# EAGLE schematic pulse_module (EAGLE 9.2.2)
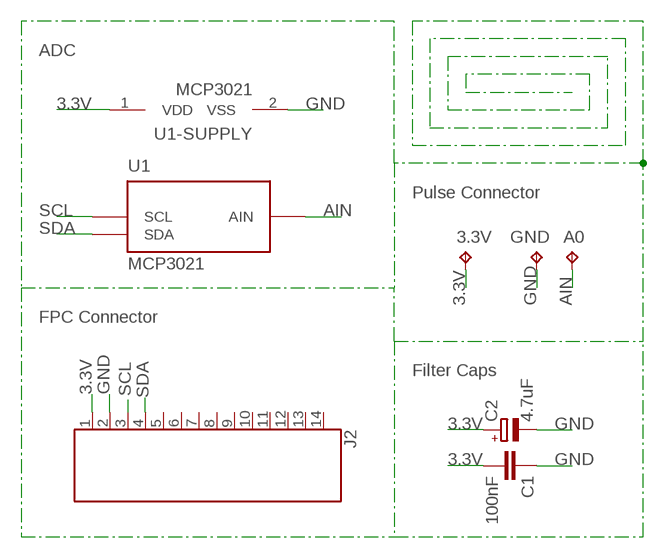
[diagram p0: schematic, sheet 1]

## Parts
3.3V  TPTP20R  [TP20R]
A0  TPTP20R  [TP20R]
C1  100nF  C-EUC1206  [C1206]
C2  4.7uF  CPOL-EUSMCA  [SMC_A]
GND  TPTP20R  [TP20R]
J2  686114183522  [686114183522]
U1  MCP3021  [SOT-23-5]

## Nets
3.3V: 3.3V.TP C1.2 C2.+ J2.1 U1.1(VDD)
AIN: A0.TP U1.3(AIN)
GND: C1.1 C2.- GND.TP J2.2 U1.2(VSS)
SCL: J2.3 U1.5(SCL)
SDA: J2.4 U1.4(SDA)
Unconnected: J2.5 J2.6 J2.7 J2.8 J2.9 J2.10 J2.11 J2.12 J2.13 J2.14

## Notes on the sheet
- ADC
- Pulse Connector
- FPC Connector
- Filter Caps

## Library data of the parts
3.3V A0 GND = testpad:TP: Test pad
C1 = rcl:C-EU: CAPACITOR, European symbol; SPICEPREFIX: C
C2 = rcl:CPOL-EU: POLARIZED CAPACITOR, European symbol; SPICEPREFIX: C
J2 = Wurth_Elektronik_Electromechanic_FPC_Connectors_&_Flat_Flexible_Cable_rev18c:686114183522: 686114183522 WR-FPC 1.00mm SMT Horizontal Bottom Contact - Low Profile <http://katalog.we-online.de/media/images/v2/Family_WR-FPC_6861xx183522.jpg> Details see: http://katalog.we-online.de/en/em/FPC_1_00_SMT_ZIF_HORIZONTAL_BOTTOM_CONTACT_LOW_PROFILE_6861xx183522 Created by Yingchun,shan 2016 (C) Wurth Elektronik
U1 = Volks73-MicrochipTechnology:MCP3*21: Analog-to-Digital Converter Low Power 10-, 12-Bit A/D Converter with I22™ Interface Documentation Datasheet <http://ww1.microchip.com/downloads/en/DeviceDoc/21805B.pdf> General Description The Microchip Technology Inc. MCP3021 is a successive approximation A/D converter (ADC) with 10-bit resolution. Available in the SOT-23 package, this device provides one single-ended input with very low power consumption. Based on an advanced CMOS technology, the MCP3021 provides a low maximum conversion current and standby current of 250 µA and 1 µA, respectively. Low current consumption, combined with the small SOT-23 package, make this device ideal for battery-powered and remote data acquisition applications. Communication to the MCP3021 is performed using a 2-wire I2C compatible interface. Standard (100 kHz) and Fast (400 kHz) I2C modes are available with the device. An on-chip conversion clock enables independent timing for the I2C and conversion clocks. The device is also addressable, allowing up to eight devices on a single 2-wire bus. The MCP3021 runs on a single supply voltage that operates over a broad range of 2.7V to 5.5V. This device also provides excellent linearity of ±1 LSB differential non-linearity (DNL) and ±1 LSB integral nonlinearity (INL), maximum. Features 10-bit resolution ±1 LSB DNL, ±1 LSB INL max. 250 µA max conversion current 5 nA typical standby current, 1 µA max. I2C™ compatible serial interface 100 kHz I2C Standard mode 400 kHz I2C Fast mode Up to 8 devices on single 2-wire bus 22.3 ksps in I2C Fast mode Single-ended analog input channel On-chip sample and hold On-chip conversion clock Single supply specified operation: 2.7V to 5.5V Temperature range: Extended: -40°C to +125°C Small SOT-23 package Applications Data Logging Multi-zone Monitoring Hand Held Portable Applications Battery Powered Test Equipment Remote or Isolated Data Acquisition; ARCHITECTURE: SAR; CONFIGURATION: S/H-ADC; DATA_INTERFACE: I2C; DESCRIPTION: IC ADC 10BIT 2.7V 1CH SOT23-5; DOCUMENTATION_LINK: <a href="http://ww1.microchip.com/downloads/en/DeviceDoc/21805B.pdf">Datasheet</a>; DOCUMENTATION_URL: http://ww1.microchip.com/downloads/en/DeviceDoc/21805B.pdf; FEATURES: -; INPUT_TYPE: Single Ended; MANUFACTURER: Microchip Technology; NUMBER_OF_AD_CONVERTERS: 1; NUMBER_OF_BITS: 10; NUMBER_OF_INPUTS: 1; OPERATING_TEMPERATURE: -40C ~ 125C; PACKAGE: SC-74A, SOT-753; PART_NUMBER: MCP3021A5T-E/OT; RATIO: 1:1; REFERENCE_TYPE: External; SAMPLING_RATE: 22.3k; SUPPLIER_DEVICE_PACKAGE: SOT-23-5; SUPPLIER_ITEM_INFO: http://www.digikey.com/product-detail/en/MCP3021A5T-E%2FOT/MCP3021A5T-E%2FOTCT-ND/1979808; SUPPLIER_ITEM_LINK: <a href="http://www.digikey.com/product-detail/en/MCP3021A5T-E%2FOT/MCP3021A5T-E%2FOTCT-ND/1979808">Details</a>; SUPPLIER_ITEM_NUMBER: MCP3021A5T-E/OTCT-ND; SUPPLIER_ITEM_URL: http://www.digikey.com/product-detail/en/MCP3021A5T-E%2FOT/MCP3021A5T-E%2FOTCT-ND/1979808; SUPPLIER_LINK: <a href="http://www.digikey.com">Home Page</a>; SUPPLIER_NAME: Digi-Key; SUPPLIER_URL: http://www.digikey.com; VOLTAGE-SUPPLY_ANALOG: 2.7V ~ 5.5V; VOLTAGE-SUPPLY_DIGITAL: 2.7V ~ 5.5V

## Net classes
0 default: width 0.254 mm, drill 0.508 mm, clearance 0.254 mm